# Altium schematic sheet schematic.SchDoc
size A3
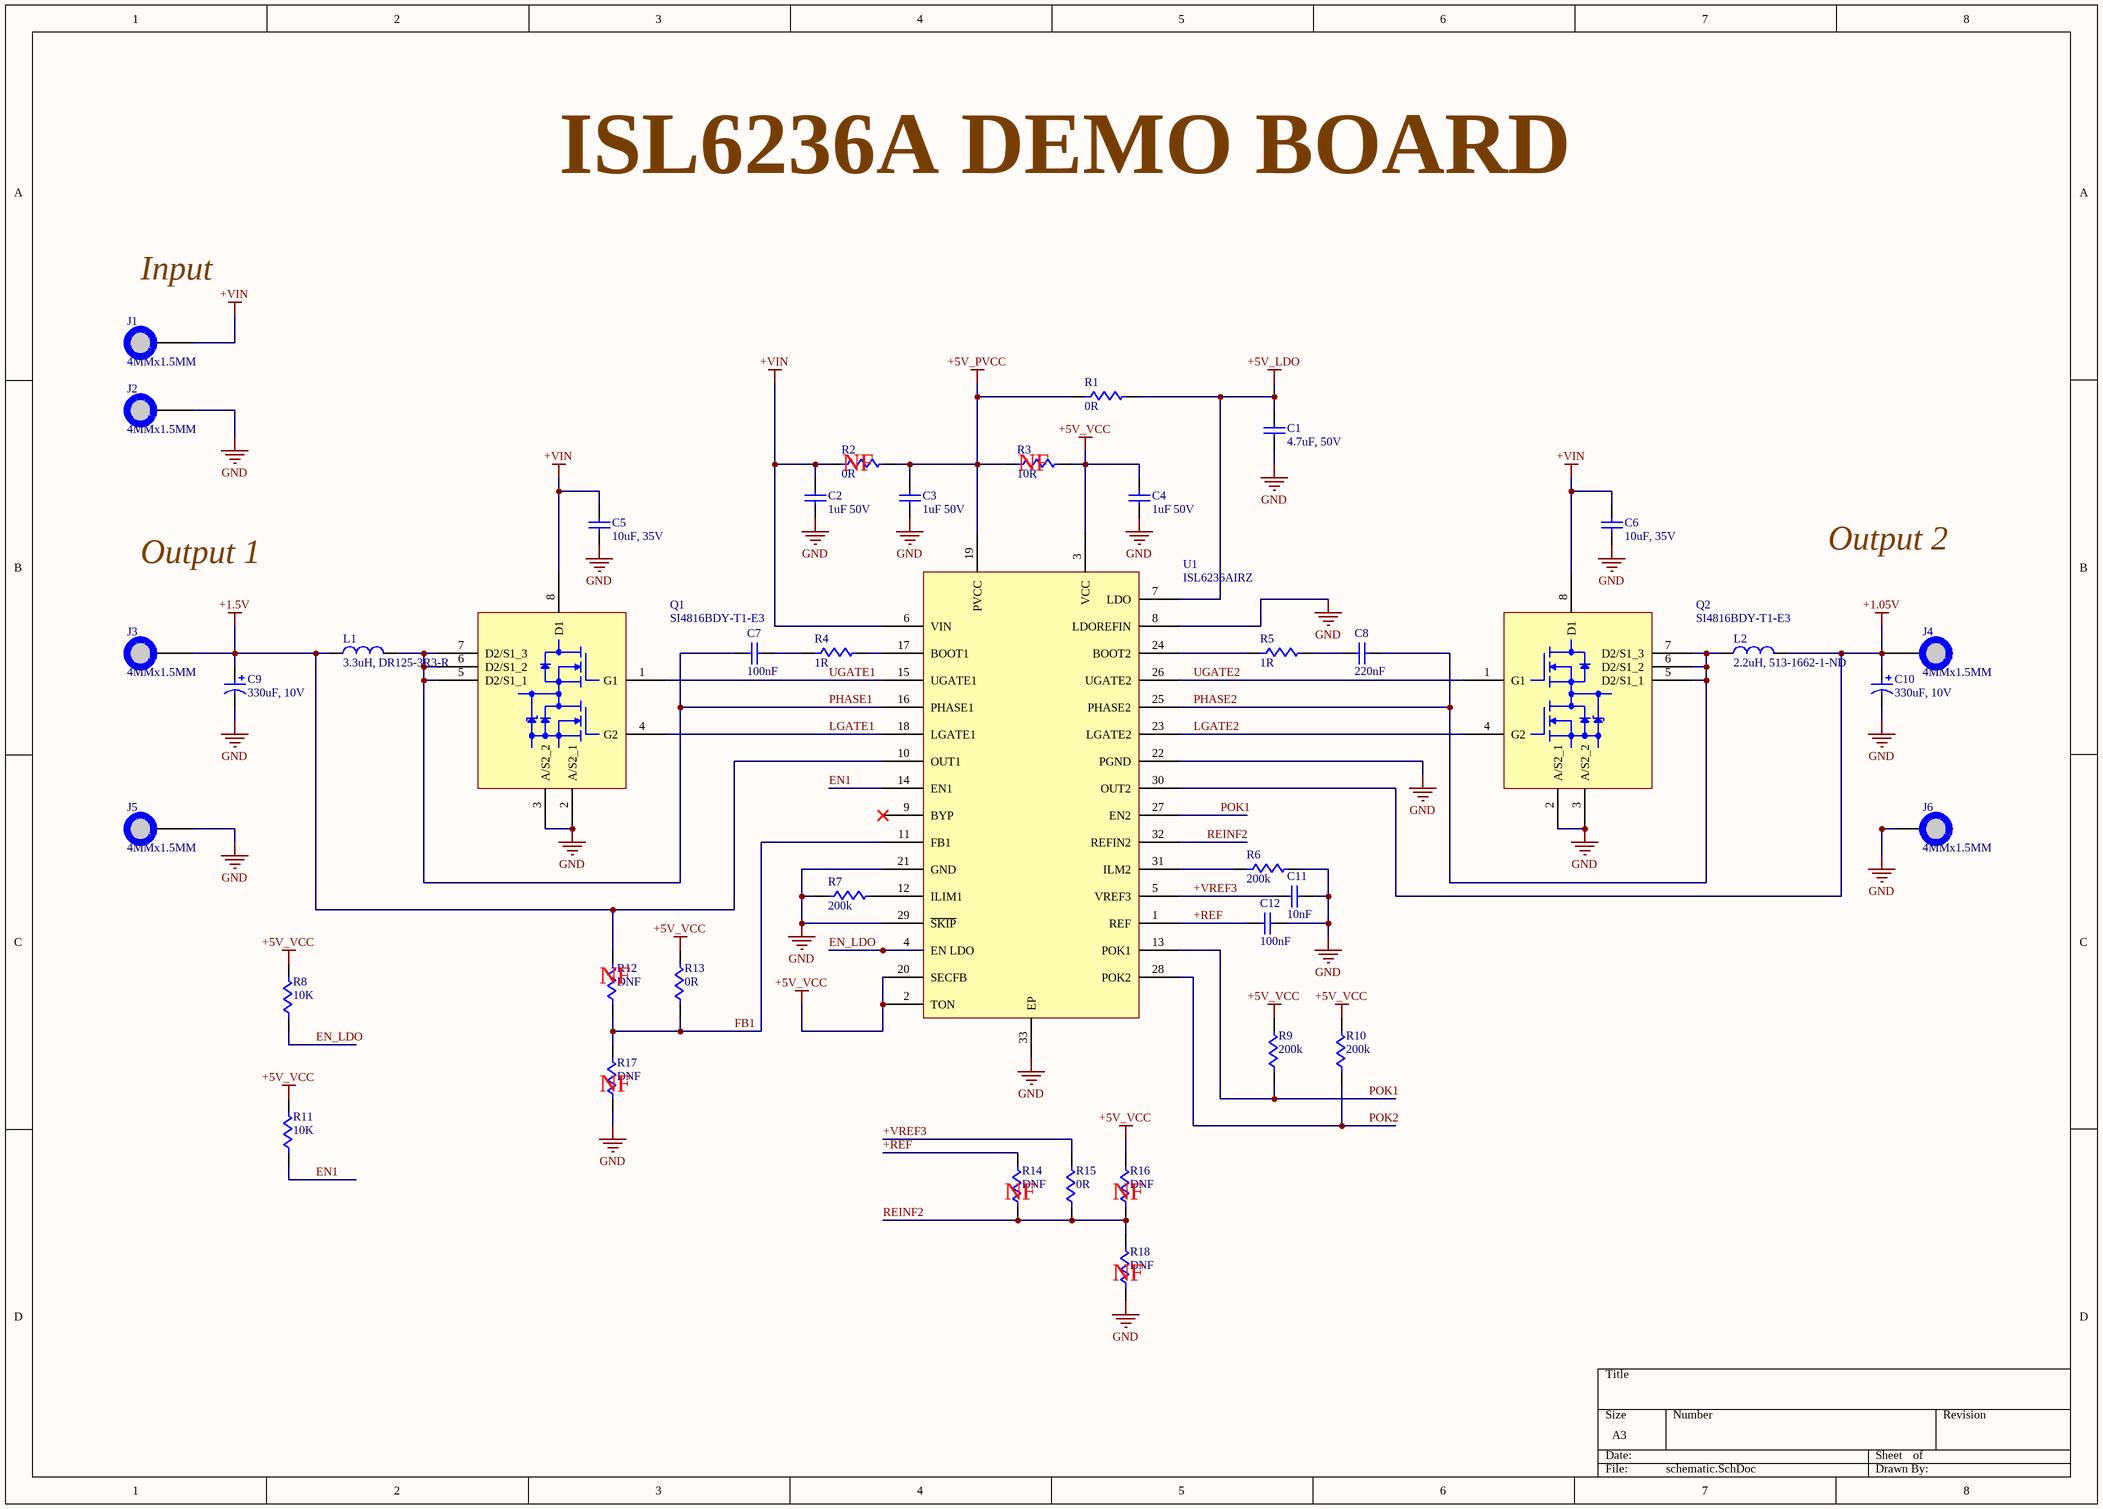
[diagram p0: schematic.SchDoc]

## Parts
C1  4.7uF, 50V  [C1206]
C2  1uF 50V  [C0805]
C3  1uF 50V  [C0805]
C4  1uF 50V  [C0805]
C5  10uF, 35V  [C1210]
C6  10uF, 35V  [C1210]
C7  100nF  [C0805]
C8  220nF  [C0805]
C9  330uF, 10V  [7343-43]
C10  330uF, 10V  [7343-43]
C11  10nF  [C0805]
C12  100nF  [C0805]
J1  4MMx1.5MM  [PAD_WITH_HOLE_4mmx1.5mm]
J2  4MMx1.5MM  [PAD_WITH_HOLE_4mmx1.5mm]
J3  4MMx1.5MM  [PAD_WITH_HOLE_4mmx1.5mm]
J4  4MMx1.5MM  [PAD_WITH_HOLE_4mmx1.5mm]
J5  4MMx1.5MM  [PAD_WITH_HOLE_4mmx1.5mm]
J6  4MMx1.5MM  [PAD_WITH_HOLE_4mmx1.5mm]
L1  3.3uH, DR125-3R3-R  [DR125]
L2  2.2uH, 513-1662-1-ND  [DR125]
Q1  SI4816BDY-T1-E3  [SO-8]
Q2  SI4816BDY-T1-E3  [SO-8]
R1  0R  [R0805]
R2  0R  [R0805]
R3  10R  [R0805]
R4  1R  [R0805]
R5  1R  [R0805]
R6  200k  [R0805]
R7  200k  [R0805]
R8  10K  [R0805]
R9  200k  [R0805]
R10  200k  [R0805]
R11  10K  [R0805]
R12  DNF  [R0805]
R13  0R  [R0805]
R14  DNF  [R0805]
R15  0R  [R0805]
R16  DNF  [R0805]
R17  DNF  [R0805]
R18  DNF  [R0805]
U1  ISL6236AIRZ  [L32.5x5B]

## Nets
+1.5V: C9.1 J3.1 L1.1 R12.2 U1.10(OUT1)
+1.05V: C10.1 J4.1 L2.2 U1.30(OUT2)
+5V_LDO: C1.2 R1.2 U1.7(LDO)
+5V_PVCC: C3.2 R1.1 R2.2 R3.1 U1.19(PVCC)
+5V_VCC: C4.2 R3.2 R8.2 R9.2 R10.2 R11.2 R13.2 R16.2 U1.2(TON) U1.3(VCC) U1.20(SECFB)
+VIN: C2.2 C5.2 C6.2 J1.1 Q1.8(D1) Q2.8(D1) R2.1 U1.6(VIN)
GND: C1.1 C2.1 C3.1 C4.1 C5.1 C6.1 C9.2 C10.2 C11.2 C12.2 J2.1 J5.1 J6.1 Q1.2(A/S2_1) Q1.3(A/S2_2) Q2.2(A/S2_1) Q2.3(A/S2_2) R6.2 R7.1 R17.1 R18.1 U1.8(LDOREFIN) U1.21(GND) U1.22(PGND) U1.29(~{SKIP}) U1.33(EP)
+REF: C12.1 R14.2 U1.1(REF)
+VREF3: C11.1 R15.2 U1.5(VREF3)
EN1: R11.1 U1.14(EN1)
EN_LDO: R8.1 U1.4(EN_LDO)
FB1: R12.1 R13.1 R17.2 U1.11(FB1)
LGATE1: Q1.4(G2) U1.18(LGATE1)
LGATE2: Q2.4(G2) U1.23(LGATE2)
PHASE1: C7.1 L1.2 Q1.5(D2/S1_1) Q1.6(D2/S1_2) Q1.7(D2/S1_3) U1.16(PHASE1)
PHASE2: C8.2 L2.1 Q2.5(D2/S1_1) Q2.6(D2/S1_2) Q2.7(D2/S1_3) U1.25(PHASE2)
POK1: R9.1 U1.13(POK1) U1.27(EN2)
POK2: R10.1 U1.28(POK2)
REINF2: R14.1 R15.1 R16.1 R18.2 U1.32(REFIN2)
UGATE1: Q1.1(G1) U1.15(UGATE1)
UGATE2: Q2.1(G1) U1.26(UGATE2)
NetC7_2: C7.2 R4.1
NetC8_1: C8.1 R5.2
NetR4_2: R4.2 U1.17(BOOT1)
NetR5_1: R5.1 U1.24(BOOT2)
NetR6_1: R6.1 U1.31(ILM2)
NetR7_2: R7.2 U1.12(ILIM1)

Not connected (* = marked no-connect by the designer): U1 9(BYP)*

## Notes on the sheet
- ISL6236A DEMO BOARD
- Input
- (near R2) NF
- (near R3) NF
- Output 1
- Output 2
- (near R12) NF
- (near R17) NF
- (near R14) NF
- (near R16) NF
- (near R18) NF

## Library data of the parts
C1 = C3216X5R1H475K160AB: C Series 1206 4.7 uF 50 V ±10 % Tolerance X5R SMT Multilayer Ceramic Capacitor; Manufacturer: TDK; Tolerance: 10%; Supplier 1: Digi-Key; Manufacturer Part Number: C3216X5R1H475K160AB; RoHS: Yes; Category: Ceramic Capacitors; Stock 1: 6706; Pricing 1: 1=0.86000, 10=0.63500, 50=0.50820, 100=0.43560, 500=0.34486, 1000=0.29040 (USD); Mount: Surface Mount; Case/Package: 1206; Weight: 0.000571oz; Case Code (Imperial): 1206; Case Code (Metric): 3216; Dielectric Material: Ceramic; Min Operating Temperature: -55°C; Max Operating Temperature: 85°C; Dielectric: X5R; Termination: SMD/SMT; Composition: Ceramic; Capacitance: 4.7uF; Packaging: Tape and Reel; Voltage Rating: 50V; Voltage Rating (DC): 50V; Package Quantity: 1; Length: 3.2mm; Height: 1.6mm; Thickness: 0.071inch; Depth: 1.6mm; Width: 1.6mm; Lead Free: Lead Free; ComponentLink1URL: https://datasheet.ciiva.com/24216/c3216x5r1h475k160ab-265269-24216325.pdf?src-supplier=Mouser; ComponentLink1Description: https://datasheet.ciiva.com/24216/c3216x5r1h475k160ab-265269-24216325.pdf?src-supplier=Mouser; ComponentLink2URL: https://datasheet.ciiva.com/6286/tdkmlcccaprange-6286230.pdf?src-supplier=Digi-Key; ComponentLink2Description: https://datasheet.ciiva.com/6286/tdkmlcccaprange-6286230.pdf?src-supplier=Digi-Key; ComponentLink3URL: https://datasheet.ciiva.com/6286/tdkmlcccaprange-6286233.pdf?src-supplier=Digi-Key; ComponentLink3Description: https://datasheet.ciiva.com/6286/tdkmlcccaprange-6286233.pdf?src-supplier=Digi-Key; ComponentLink4URL: https://datasheet.ciiva.com/6286/tdkmlcccaprange-6286236.pdf?src-supplier=Digi-Key; ComponentLink4Description: https://datasheet.ciiva.com/6286/tdkmlcccaprange-6286236.pdf?src-supplier=Digi-Key; Supplier Part Number 1: 445-5994-1-ND
C2-C4 = C0805C105K5RACTU: CAP CER 1UF 50V X7R 0805; Manufacturer: KEMET; Dielectric Material: Ceramic; Tolerance: 10%; Supplier 1: Digi-Key; Manufacturer Part Number: C0805C105K5RACTU; RoHS: Yes; Category: Ceramic Capacitors; Stock 1: 143406; Pricing 1: 1=0.38000, 10=0.26500, 50=0.18540, 100=0.15900, 500=0.11924, 1000=0.10070 (USD); Mount: Surface Mount,PCB; Case/Package: 0805; Case Code (Metric): 2012; Case Code (Imperial): 0805; Contact Plating: Tin,Matte; Min Operating Temperature: -55°C; Max Operating Temperature: 125°C; Packaging: Tape and Reel; Capacitance: 1uF; Voltage Rating: 50V; Voltage Rating (DC): 50V; Package Quantity: 1; Dielectric: X7R; Termination: SMD/SMT; Voltage: 50V; Length: 2mm; Height: 1.25mm; Width: 0.049inch; Thickness: 0.055inch; Depth: 1.25mm; REACH SVHC: No SVHC; ComponentLink1URL: https://datasheet.ciiva.com/7842/1732744-7842192.pdf?src-supplier=Element14; ComponentLink1Description: https://datasheet.ciiva.com/7842/1732744-7842192.pdf?src-supplier=Element14; ComponentLink2URL: https://datasheet.ciiva.com/5408/kem-c1002-x7r-smd-5408569.pdf?src-supplier=Mouser; ComponentLink2Description: https://datasheet.ciiva.com/5408/kem-c1002-x7r-smd-5408569.pdf?src-supplier=Mouser; ComponentLink3URL: https://datasheet.ciiva.com/22700/1851736-22700523.pdf?src-supplier=Element14; ComponentLink3Description: https://datasheet.ciiva.com/22700/1851736-22700523.pdf?src-supplier=Element14; Supplier Part Number 1: 399-7409-1-ND
C5 C6 = C1210C106K6PACTU: KEMET - C1210C106K6PACTU - SMD Multilayer Ceramic Capacitor, 10 µF, 35 V, 1210 [3225 Metric], ± 10%, X5R, C Series KEMET; Dissipation Factor: 2.5%; Supplier 1: Digi-Key; Manufacturer: KEMET; Manufacturer Part Number: C1210C106K6PACTU; RoHS: Yes; Category: Ceramic Capacitors; Stock 1: 38018; Pricing 1: 1=0.78000, 10=0.57700, 50=0.46180, 100=0.39580, 500=0.31336, 1000=0.26388 (USD); Mount: Surface Mount; Case/Package: 1210; Dielectric Material: Ceramic; Case Code (Metric): 3225; Case Code (Imperial): 1210; Min Operating Temperature: -55°C; Max Operating Temperature: 85°C; Packaging: Tape and Reel; Capacitance: 10uF; Voltage Rating: 35V; Voltage: 35V; Dielectric: X5R; Termination: Solder; Tolerance: 10%; Voltage Rating (DC): 35V; Length: 0.126inch; Height: 1.9mm; Width: 0.098inch; Thickness: 0.083inch; Depth: 2.5mm; Lead Free: Lead Free; ComponentLink1URL: http://www.alliedelec.com/m/d/f3c02ddb98afa3dd1adcb801109671e9.pdf?src-supplier=Allied+Electronics; ComponentLink1Description: http://www.alliedelec.com/m/d/f3c02ddb98afa3dd1adcb801109671e9.pdf?src-supplier=Allied+Electronics; ComponentLink2URL: http://www.farnell.com/datasheets/2741192.pdf?src-supplier=Farnell; ComponentLink2Description: http://www.farnell.com/datasheets/2741192.pdf?src-supplier=Farnell; ComponentLink3URL: https://api.kemet.com/component-edge/download/datasheet/C1210C106K6PAC7800.pdf?src-supplier=Digi-Key; ComponentLink3Description: https://api.kemet.com/component-edge/download/datasheet/C1210C106K6PAC7800.pdf?src-supplier=Digi-Key; ComponentLink4URL: http://www.farnell.com/datasheets/2741192.pdf?src-supplier=Newark; ComponentLink4Description: http://www.farnell.com/datasheets/2741192.pdf?src-supplier=Newark; ComponentLink5URL: http://www.kemet.com/docfinder?Partnumber=C1210C106K6PAC7800&src-supplier=Digi-Key; ComponentLink5Description: http://www.kemet.com/docfinder?Partnumber=C1210C106K6PAC7800&src-supplier=Digi-Key; Supplier Part Number 1: 399-12070-1-ND
C7 C12 = C0805C104K5RACTU: Cap Ceramic 0.1uF 50V X7R 10% SMD 2.0 x 1.2 mm 125 C Paper T/R; Manufacturer: KEMET; Voltage: 500V; Supplier 1: Digi-Key; Manufacturer Part Number: C0805C104K5RACTU; RoHS: Yes; Category: Ceramic Capacitors; Stock 1: 2631110; Pricing 1: 1=0.16000, 10=0.11500, 50=0.06540, 100=0.05420, 500=0.03802, 1000=0.03147 (USD); Mount: Surface Mount,PCB; Case/Package: 0805; Number of Pins: 2; Dielectric Material: Ceramic; Case Code (Imperial): 0805; Case Code (Metric): 2012; Contact Plating: Tin,Matte; Min Operating Temperature: -55°C; Max Operating Temperature: 125°C; Capacitance: 100nF; Tolerance: 10%; Packaging: Tape and Reel; Voltage Rating (DC): 50V; Dielectric: X7R; Termination: SMD/SMT; Package Quantity: 4000; Voltage Rating: 50V; Length: 2mm; Height: 0.9mm; Width: 1.2mm; Lead Pitch: 0.75mm; Depth: 1.25mm; Thickness: 0.035inch; Radiation Hardening: No; REACH SVHC: No SVHC; ComponentLink1URL: https://datasheet.ciiva.com/14589/70095383-14589048.pdf?src-supplier=Allied+Electronics; ComponentLink1Description: https://datasheet.ciiva.com/14589/70095383-14589048.pdf?src-supplier=Allied+Electronics; ComponentLink2URL: https://datasheet.ciiva.com/28682/1851736-28682232.pdf?src-supplier=Element14; ComponentLink2Description: https://datasheet.ciiva.com/28682/1851736-28682232.pdf?src-supplier=Element14; ComponentLink3URL: https://datasheet.ciiva.com/32431/slceramic-chip-condensers-e-32431755.pdf?src-supplier=Distrelec; ComponentLink3Description: https://datasheet.ciiva.com/32431/slceramic-chip-condensers-e-32431755.pdf?src-supplier=Distrelec; ComponentLink4URL: https://datasheet.ciiva.com/18410/70095383-18410815.pdf?src-supplier=Allied+Electronics; ComponentLink4Description: https://datasheet.ciiva.com/18410/70095383-18410815.pdf?src-supplier=Allied+Electronics; Supplier Part Number 1: 399-1170-1-ND
C8 = C0805C224K5RACTU: CAP CER 0.22UF 50V X7R 0805; Manufacturer: KEMET; Dielectric Material: Ceramic; Tolerance: 10%; Dissipation Factor: 2.5%; Supplier 1: Digi-Key; Manufacturer Part Number: C0805C224K5RACTU; RoHS: Yes; Category: Ceramic Capacitors; Stock 1: 971801; Pricing 1: 1=0.19000, 10=0.13300, 50=0.07560, 100=0.06260, 500=0.04392, 1000=0.03636 (USD); Mount: Surface Mount,PCB; Case/Package: 0805; Case Code (Metric): 2012; Case Code (Imperial): 0805; Min Operating Temperature: -55°C; Max Operating Temperature: 125°C; Package Quantity: 1; Capacitance: 220nF; Voltage Rating: 50V; Packaging: Tape and Reel; Voltage Rating (DC): 50V; Dielectric: X7R; Termination: SMD/SMT; Voltage: 50V; Length: 2mm; Height: 1.1mm; Width: 0.049inch; Thickness: 0.055inch; Lead Pitch: 0.75mm; Depth: 1.25mm; Radiation Hardening: No; REACH SVHC: No SVHC; ComponentLink1URL: https://datasheet.ciiva.com/7842/kem-c1002-x7r-smd-7842582.pdf?src-supplier=Element14; ComponentLink1Description: https://datasheet.ciiva.com/7842/kem-c1002-x7r-smd-7842582.pdf?src-supplier=Element14; ComponentLink2URL: https://datasheet.ciiva.com/18193/getdatasheetpartid-304413-18193686.pdf?src-supplier=Verical; ComponentLink2Description: https://datasheet.ciiva.com/18193/getdatasheetpartid-304413-18193686.pdf?src-supplier=Verical; ComponentLink3URL: https://datasheet.ciiva.com/28682/1851736-28682316.pdf?src-supplier=Element14; ComponentLink3Description: https://datasheet.ciiva.com/28682/1851736-28682316.pdf?src-supplier=Element14; Supplier Part Number 1: 399-3491-6-ND
C9 C10 = T530X337M010ATE004: Tantalum Capacitors - Polymer SMD 330uF 10volts 20%; Manufacturer: KEMET; Ripple Current: 8.2A; ESR (Equivalent Series Resistance): 4mR; Life (Hours): 2000Hour; Leakage Current: 330uA; Polarity: Polar; Dissipation Factor: 8%; Supplier 1: Digi-Key; Manufacturer Part Number: T530X337M010ATE004; RoHS: Yes; Category: Polymer Capacitors; Stock 1: 1977; Pricing 1: 1=6.56000, 10=5.83000, 50=5.10120, 100=4.66400 (USD); Mount: Surface Mount,PCB; Case/Package: 2917; Case Code (Imperial): 2917; Case Code (Metric): 7343; Min Operating Temperature: -55°C; Max Operating Temperature: 125°C; Package Quantity: 500; Voltage Rating (DC): 10V; Capacitance: 330uF; Tolerance: 20%; Packaging: Tape and Reel; Termination: SMD/SMT; Voltage: 10V; Features: General Purpose; Voltage Rating: 10V; Length: 7.3mm; Height: 4mm; Height - Seated (Max): 0.169inch; Depth: 4.3mm; Width: 4.3mm; REACH SVHC: No SVHC; ComponentLink1URL: https://datasheet.ciiva.com/11794/0900766b80deaa91-11794477.pdf?src-supplier=RSComponents; ComponentLink1Description: https://datasheet.ciiva.com/11794/0900766b80deaa91-11794477.pdf?src-supplier=RSComponents; ComponentLink2URL: https://datasheet.ciiva.com/14593/70096008-14593753.pdf?src-supplier=Allied+Electronics; ComponentLink2Description: https://datasheet.ciiva.com/14593/70096008-14593753.pdf?src-supplier=Allied+Electronics; Supplier Part Number 1: 399-10378-1-ND
C11 = C0805F103K5RACTU: KEMET - C0805F103K5RACTU - SMD Multilayer Ceramic Capacitor, FO-CAP, 10000 pF, 50 V, 0805 [2012 Metric], ± 10%, X7R; Voltage Rating: 50V; Supplier 1: Digi-Key; Manufacturer: KEMET; Manufacturer Part Number: C0805F103K5RACTU; RoHS: Yes; Category: Ceramic Capacitors; Stock 1: 93831; Pricing 1: 1=0.33000, 10=0.22600, 50=0.15800, 100=0.13550, 500=0.10162, 1000=0.08580 (USD); Mount: Surface Mount; Case/Package: 0805; Number of Pins: 2; Case Code (Imperial): 0805; Case Code (Metric): 2012; Dielectric Material: Ceramic; Min Operating Temperature: -55°C; Max Operating Temperature: 125°C; Capacitance: 10nF; Package Quantity: 4000; Voltage Rating (DC): 50V; Tolerance: 10%; Packaging: Tape and Reel; Dielectric: X7R; Termination: SMD/SMT; Voltage: 50V; Length: 2mm; Height: 0.9mm; Width: 1.25mm; Lead Pitch: 0.75mm; Thickness: 0.039inch; Depth: 1.25mm; Radiation Hardening: No; REACH SVHC: No SVHC; ComponentLink1URL: https://datasheet.ciiva.com/146/docfinderpartnumber-c0805f103k5ractu-146278.pdf?src-supplier=Digi-Key; ComponentLink1Description: https://datasheet.ciiva.com/146/docfinderpartnumber-c0805f103k5ractu-146278.pdf?src-supplier=Digi-Key; ComponentLink2URL: https://datasheet.ciiva.com/7842/48829-7842407.pdf?src-supplier=Element14; ComponentLink2Description: https://datasheet.ciiva.com/7842/48829-7842407.pdf?src-supplier=Element14; ComponentLink3URL: https://datasheet.ciiva.com/7842/48829-7842408.pdf?src-supplier=Element14; ComponentLink3Description: https://datasheet.ciiva.com/7842/48829-7842408.pdf?src-supplier=Element14; Supplier Part Number 1: 399-5107-1-ND
J1-J6 = PAD_WITH_HOLE_4mmx1.5mm: Pad with a hole 4mm x 1.5mm
L1 = DR125-3R3-R: COILTRONICS         DR125-3R3-R             Surface Mount Power Inductor, DR Series, 3.3 H, 9.26 A, 12.7 A, Shielded; Manufacturer: Eaton Coiltronics; Core Material: Ferrite; Max DC Current: 12.7A; DC Resistance (DCR): 6.3mR; Test Frequency: 100kHz; RMS Current (Irms): 9.26A; Tolerance: 20%; Supplier 1: Digi-Key; Manufacturer Part Number: DR125-3R3-R; RoHS: Yes; Category: Fixed Inductors; Stock 1: 1813; Pricing 1: 1=1.86000, 10=1.71900, 25=1.57560, 50=1.34640, 100=1.20320, 250=1.03132 (USD); Mount: Surface Mount; Case/Package: 0125; Number of Pins: 2; Weight: 0.144oz; Min Operating Temperature: -40°C; Max Operating Temperature: 125°C; Inductance: 3.3uH; Termination: SMD/SMT; Military Standard: Not; Saturation Current: 12.7A; Self Resonant Frequency: 100kHz; Packaging: Tape and Reel; Shielding: Shielded; Package Quantity: 600; Inductance Tolerance: 20%; Length: 12.5mm; Height: 6mm; Depth: 12.5mm; Width: 12.5mm; Radiation Hardening: No; REACH SVHC: No SVHC; Lead Free: Lead Free; ComponentLink1URL: https://datasheet.ciiva.com/46609/87246-46609257.pdf?src-supplier=Element14; ComponentLink1Description: https://datasheet.ciiva.com/46609/87246-46609257.pdf?src-supplier=Element14; Supplier Part Number 1: 513-1529-1-ND
L2 = DR125-2R2-R: FIXED IND 2.2UH 10.9A 4.5 MOHM; Manufacturer: Eaton Cooper; Core Material: Ferrite; DC Resistance (DCR): 4.5mR; Test Frequency: 100kHz; Saturation Current: 15A; Tolerance: 20%; Shielding: Shielded; Supplier 1: Future Electronics; Manufacturer Part Number: DR125-2R2-R; RoHS: Yes; Category: Fixed Inductors; Stock 1: 700; Pricing 1: 1=2.17000, 25=1.69000, 50=1.60000, 100=1.52000, 250=1.41000 (USD); Mount: Surface Mount; Case/Package: Nonstandard; Number of Pins: 2; Weight: 0.144oz; Min Operating Temperature: -40°C; Max Operating Temperature: 125°C; Composition: Wirewound; Max DC Current: 10.9A; Termination: SMD/SMT; Self Resonant Frequency: 100kHz; DC Current: 10.9A; Military Standard: Not; RMS Current (Irms): 10.9A; Package Quantity: 600; Current Rating: 10.9A; Packaging: Tape and Reel; Inductance: 2.2uH; Inductance Tolerance: 20%; Length: 12.5mm; Height: 6mm; Height - Seated (Max): 0.236inch; Depth: 12.5mm; Width: 0.492inch; Radiation Hardening: No; Lead Free: Lead Free; REACH SVHC: No SVHC; ComponentLink1URL: https://datasheet.ciiva.com/14667/0900766b8116a153-14667792.pdf?src-supplier=RSComponents; ComponentLink1Description: https://datasheet.ciiva.com/14667/0900766b8116a153-14667792.pdf?src-supplier=RSComponents; ComponentLink2URL: https://datasheet.ciiva.com/26926/getdatasheetpartid-571249-26926912.pdf?src-supplier=Verical; ComponentLink2Description: https://datasheet.ciiva.com/26926/getdatasheetpartid-571249-26926912.pdf?src-supplier=Verical; ComponentLink3URL: https://datasheet.ciiva.com/8004/87246-8004874.pdf?src-supplier=Element14; ComponentLink3Description: https://datasheet.ciiva.com/8004/87246-8004874.pdf?src-supplier=Element14; Supplier Part Number 1: DR125-2R2-R-CUTT
Q1 Q2 = SI4816BDY-T1-E3: MOSFET 2N-CH 30V 5.8A 8-SOIC; Manufacturer: Vishay Siliconix; FET Type: 2 N-Channel; Element Configuration: Single; Nominal Vgs: 3V; Rise Time: 9ns; Rds On Max: 18.5mR; Continuous Drain Current (ID): 8.2A; Drain to Source Resistance: 11.5mR; Gate to Source Voltage (Vgs): 20V; Max Power Dissipation: 1.25W; Turn-Off Delay Time: 31ns; Turn-On Delay Time: 13ns; Threshold Voltage: 1V; Number of Elements: 2; Supplier 1: Digi-Key; Manufacturer Part Number: SI4816BDY-T1-E3; RoHS: Yes; Category: MOSFETs; Stock 1: 4053; Pricing 1: 1=1.56000, 10=1.40500, 25=1.32520, 100=1.03350, 500=0.87450, 1000=0.74200 (USD); Mount: Surface Mount; Case/Package: SO; Number of Pins: 8; Weight: 0.006596oz; Min Operating Temperature: -55°C; Max Operating Temperature: 150°C; Packaging: Tape and Reel; Package Quantity: 1; Drain to Source Voltage (Vdss): 30V; Fall Time: 9ns; On-State Resistance: 18.5mR; Number of Channels: 2; Length: 5mm; Height: 1.55mm; Width: 4mm; Radiation Hardening: No; Lead Free: Lead Free; REACH SVHC: Unknown; ComponentLink1URL: https://datasheet.ciiva.com/15137/getdatasheetpartid-99188-15137841.pdf?src-supplier=Verical; ComponentLink1Description: https://datasheet.ciiva.com/15137/getdatasheetpartid-99188-15137841.pdf?src-supplier=Verical; ComponentLink2URL: https://datasheet.ciiva.com/7710/si4816bd-7710449.pdf?src-supplier=Element14; ComponentLink2Description: https://datasheet.ciiva.com/7710/si4816bd-7710449.pdf?src-supplier=Element14; ComponentLink3URL: https://datasheet.ciiva.com/26789/si4816bdy-t1-e3-26789112.pdf?src-supplier=IIIC; ComponentLink3Description: https://datasheet.ciiva.com/26789/si4816bdy-t1-e3-26789112.pdf?src-supplier=IIIC; ComponentLink4URL: https://datasheet.ciiva.com/11161/si4816bd-11161496.pdf?src-supplier=Avnet; ComponentLink4Description: https://datasheet.ciiva.com/11161/si4816bd-11161496.pdf?src-supplier=Avnet; ComponentLink5URL: https://datasheet.ciiva.com/928/si4816bd-928460.pdf?src-supplier=Digi-Key; ComponentLink5Description: https://datasheet.ciiva.com/928/si4816bd-928460.pdf?src-supplier=Digi-Key; ComponentLink6URL: https://datasheet.ciiva.com/16486/si4816bd-16486349.pdf?src-supplier=Future+Electronics; ComponentLink6Description: https://datasheet.ciiva.com/16486/si4816bd-16486349.pdf?src-supplier=Future+Electronics; ComponentLink7URL: https://datasheet.ciiva.com/26136/si4816bd-26136990.pdf?src-supplier=Avnet+Europe; ComponentLink7Description: https://datasheet.ciiva.com/26136/si4816bd-26136990.pdf?src-supplier=Avnet+Europe; ComponentLink8URL: https://datasheet.ciiva.com/18448/70026226-18448822.pdf?src-supplier=Allied+Electronics; ComponentLink8Description: https://datasheet.ciiva.com/18448/70026226-18448822.pdf?src-supplier=Allied+Electronics; ComponentLink9URL: https://datasheet.ciiva.com/928/si4816bd-928458.pdf?src-supplier=Digi-Key; ComponentLink9Description: https://datasheet.ciiva.com/928/si4816bd-928458.pdf?src-supplier=Digi-Key; ComponentLink10URL: https://datasheet.ciiva.com/928/si4816bd-928459.pdf?src-supplier=Digi-Key; ComponentLink10Description: https://datasheet.ciiva.com/928/si4816bd-928459.pdf?src-supplier=Digi-Key; Supplier Part Number 1: SI4816BDY-T1-E3CT-ND
R1 R2 R13 R15 = AC0805JR-070RL: Thick Film Resistors - SMD 1/8W 0.0ohm 5%; Manufacturer: Yageo; Temperature Coefficient: 200ppm/°C; Max Power Dissipation: 125mW; Voltage Rating: 150V; Resistance: 0mR; Supplier 1: Digi-Key; Manufacturer Part Number: AC0805JR-070RL; RoHS: Yes; Category: Chip SMD Resistors; Stock 1: 68620; Pricing 1: 1=0.10000, 10=0.04000, 25=0.02880, 50=0.02180, 100=0.01610, 250=0.01228, 500=0.00982, 1000=0.00723 (USD); Case/Package: 0805; Case Code (Imperial): 0805; Case Code (Metric): 2012; Min Operating Temperature: -55°C; Max Operating Temperature: 155°C; Features: Moisture Resistant,Automotive AEC-Q200; Composition: Thick Film; Termination: SMD/SMT; Number of Terminations: 2; Power Rating: 125mW; Packaging: Tape and Reel; Tolerance: 5%; Length: 0.079inch; Height: 0.024inch; Width: 1.25mm; Lead Free: Lead Free; ComponentLink1URL: http://www.yageo.com/documents/recent/PYu-AC_51_RoHS_L_2.pdf?src-supplier=Mouser; ComponentLink1Description: http://www.yageo.com/documents/recent/PYu-AC_51_RoHS_L_2.pdf?src-supplier=Mouser; ComponentLink2URL: http://www.yageo.com/NewPortal/yageodocoutput?fileName=/pdf/R-Chip/PYu-AC_51_RoHS_L_6.pdf&src-supplier=Digi-Key; ComponentLink2Description: http://www.yageo.com/NewPortal/yageodocoutput?fileName=/pdf/R-Chip/PYu-AC_51_RoHS_L_6.pdf&src-supplier=Digi-Key; Supplier Part Number 1: YAG3755CT-ND
R3 = AC0805FR-0710RL: Res Thick Film 0805 10 Ohm 1% 0.125W(1/8W) ±200ppm/C Sulfur Resistant Molded SMD Automotive Paper T/R; Manufacturer: Yageo; Power Rating: 125mW; Voltage Rating: 150V; Temperature Coefficient: 200ppm/°C; Supplier 1: Digi-Key; Manufacturer Part Number: AC0805FR-0710RL; RoHS: Yes; Category: Chip SMD Resistors; Stock 1: 38355; Pricing 1: 1=0.10000, 10=0.08300, 100=0.03210, 1000=0.01410, 2500=0.01218 (USD); Case/Package: 0805; Case Code (Imperial): 0805; Case Code (Metric): 2012; Min Operating Temperature: -55°C; Max Operating Temperature: 155°C; Packaging: Tape and Reel; Resistance: 10R; Tolerance: 1%; Composition: Thick Film; Termination: SMD/SMT; Number of Terminations: 2; Military Standard: Not; Max Power Dissipation: 125mW; Features: Moisture Resistant,Automotive AEC-Q200; Length: 2mm; Height: 0.024inch; Width: 1.25mm; Depth: 1.25mm; Lead Free: Lead Free; ComponentLink1URL: http://www.mouser.com/ds/2/447/yageodocoutput-1111992.pdf?src-supplier=Mouser; ComponentLink1Description: http://www.mouser.com/ds/2/447/yageodocoutput-1111992.pdf?src-supplier=Mouser; ComponentLink2URL: http://components.arrow.com/part/dataview/0323_03350463?src-supplier=Arrow+Europe; ComponentLink2Description: http://components.arrow.com/part/dataview/0323_03350463?src-supplier=Arrow+Europe; ComponentLink3URL: http://www.yageo.com/NewPortal/yageodocoutput?fileName=/pdf/R-Chip/PYu-AC_51_RoHS_L_6.pdf&src-supplier=Digi-Key; ComponentLink3Description: http://www.yageo.com/NewPortal/yageodocoutput?fileName=/pdf/R-Chip/PYu-AC_51_RoHS_L_6.pdf&src-supplier=Digi-Key; ComponentLink4URL: http://www.yageo.com/documents/recent/PYu-AC_51_RoHS_L_2_revised.pdf?src-supplier=Future+Electronics; ComponentLink4Description: http://www.yageo.com/documents/recent/PYu-AC_51_RoHS_L_2_revised.pdf?src-supplier=Future+Electronics; Supplier Part Number 1: YAG3690CT-ND
R4 R5 = AC0805FR-071RL: RES SMD 1 OHM 1% 1/8W 0805; Manufacturer: Yageo; Voltage Rating: 150V; Power Rating: 125mW; Temperature Coefficient: 200ppm/°C; Supplier 1: Digi-Key; Manufacturer Part Number: AC0805FR-071RL; RoHS: Yes; Category: Chip SMD Resistors; Stock 1: 14398; Pricing 1: 1=0.10000, 10=0.08300, 100=0.03210, 1000=0.01410, 2500=0.01218 (USD); Case/Package: 0805; Weight: 0.000194oz; Case Code (Imperial): 0805; Case Code (Metric): 2012; Min Operating Temperature: -55°C; Max Operating Temperature: 155°C; Features: Moisture Resistant,Automotive AEC-Q200; Packaging: Tape and Reel; Tolerance: 1%; Resistance: 1R; Max Power Dissipation: 125mW; Composition: Thick Film; Number of Terminations: 2; Termination: SMD/SMT; Length: 0.079inch; Height: 0.024inch; Width: 0.049inch; Lead Free: Lead Free; ComponentLink1URL: https://datasheet.ciiva.com/12576/pyu-ac-51-rohs-l-2-12576553.pdf?src-supplier=Mouser; ComponentLink1Description: https://datasheet.ciiva.com/12576/pyu-ac-51-rohs-l-2-12576553.pdf?src-supplier=Mouser; Supplier Part Number 1: YAG3705CT-ND
R6 R7 R9 R10 = AC0805FR-07200KL: Res Thick Film 0805 200K Ohm 1% 0.125W(1/8W) ±100ppm/C Epoxy Pad SMD Automotive T/R; Manufacturer: Yageo; Power Rating: 125mW; Resistance: 200kR; Voltage Rating: 150V; Temperature Coefficient: 100ppm/°C; Supplier 1: Digi-Key; Manufacturer Part Number: AC0805FR-07200KL; RoHS: Yes; Category: Chip SMD Resistors; Stock 1: 10614; Pricing 1: 1=0.10000, 10=0.04700, 100=0.01900, 1000=0.00853, 2500=0.00741 (USD); Case/Package: 0805; Case Code (Imperial): 0805; Case Code (Metric): 2012; Min Operating Temperature: -55°C; Max Operating Temperature: 155°C; Tolerance: 1%; Packaging: Tape and Reel; Composition: Thick Film; Number of Terminations: 2; Termination: SMD/SMT; Max Power Dissipation: 125mW; Features: Moisture Resistant,Automotive AEC-Q200; Length: 0.079inch; Height: 0.024inch; Width: 0.049inch; Lead Free: Lead Free; ComponentLink1URL: http://www.mouser.com/ds/2/447/yageodocoutput-1111992.pdf?src-supplier=Mouser; ComponentLink1Description: http://www.mouser.com/ds/2/447/yageodocoutput-1111992.pdf?src-supplier=Mouser; ComponentLink2URL: http://www.yageo.com/NewPortal/yageodocoutput?fileName=/pdf/R-Chip/PYu-AC_51_RoHS_L_6.pdf&src-supplier=Digi-Key; ComponentLink2Description: http://www.yageo.com/NewPortal/yageodocoutput?fileName=/pdf/R-Chip/PYu-AC_51_RoHS_L_6.pdf&src-supplier=Digi-Key; ComponentLink3URL: http://www.yageo.com/documents/recent/PYu-AC_51_RoHS_L_2.pdf?src-supplier=Future+Electronics; ComponentLink3Description: http://www.yageo.com/documents/recent/PYu-AC_51_RoHS_L_2.pdf?src-supplier=Future+Electronics; Supplier Part Number 1: YAG3706CT-ND
R8 R11 = AC0805FR-0710KL: RES SMD 10K OHM 1% 1/8W 0805; Manufacturer: Yageo; Resistance: 10kR; Power Rating: 125mW; Voltage Rating: 150V; Temperature Coefficient: 100ppm/°C; Supplier 1: Digi-Key; Manufacturer Part Number: AC0805FR-0710KL; RoHS: Yes; Category: Chip SMD Resistors; Stock 1: 540969; Pricing 1: 1=0.10000, 10=0.04700, 100=0.01900, 1000=0.00853, 2500=0.00741 (USD); Case/Package: 0805; Case Code (Metric): 2012; Case Code (Imperial): 0805; Min Operating Temperature: -55°C; Max Operating Temperature: 155°C; Packaging: Tape and Reel; Tolerance: 1%; Package Quantity: 1; Composition: Thick Film; Number of Terminations: 2; Termination: SMD/SMT; Military Standard: Not; Max Power Dissipation: 125mW; Features: Moisture Resistant,Automotive AEC-Q200,Anti-Sulfur; Length: 0.079inch; Height: 0.024inch; Width: 0.049inch; Depth: 1.25mm; Lead Free: Lead Free; ComponentLink1URL: https://datasheet.ciiva.com/5558/pyu-ac-51-rohs-l-2-5558347.pdf?src-supplier=Mouser; ComponentLink1Description: https://datasheet.ciiva.com/5558/pyu-ac-51-rohs-l-2-5558347.pdf?src-supplier=Mouser; Supplier Part Number 1: 311-10KLGCT-ND
R12 R14 R16-R18 = RES
U1 = ISL6236AIRZ: IC MAIN PWR CTRLR QUAD 32-QFN; Manufacturer: Intersil; Number of Outputs: 2; Output Current: 20A; Switching Frequency: 500kHz; Supplier 1: Avnet; RoHS: Yes; Category: Voltage Regulators - Switching; Pricing 1: 600=3.10391, 720=3.03600, 1320=2.99000, 3000=2.94400, 6000=2.89800 (USD); Mount: Surface Mount; Case/Package: QFN; Min Operating Temperature: -40°C; Max Operating Temperature: 100°C; Packaging: Rail/Tube; Package Quantity: 60; Length: 5mm; Height: 0.95mm; Width: 5mm; Radiation Hardening: No; Lead Free: Lead Free; ComponentLink1URL: https://datasheet.ciiva.com/25905/fn6453-25905351.pdf?src-supplier=Avnet+Europe; ComponentLink1Description: https://datasheet.ciiva.com/25905/fn6453-25905351.pdf?src-supplier=Avnet+Europe; Manufacturer Part Number: ISL6236AIRZ; Supplier Part Number 1: ISL6236AIRZ